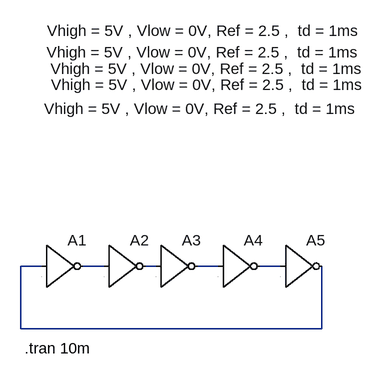
[diagram p0: schematic RING_OSCILLATOR.asc]
RING_OSCILLATOR.asc, the LTspice schematic file:
Version 4
SHEET 1 1020 680
WIRE 96 160 64 160
WIRE 192 160 160 160
WIRE 272 160 256 160
WIRE 368 160 336 160
WIRE 464 160 432 160
WIRE 64 256 64 160
WIRE 528 256 528 160
WIRE 528 256 64 256
SYMBOL Digital\\inv 96 96 R0
WINDOW 3 4 -178 Left 2
SYMATTR InstName A1
SYMATTR Value Vhigh = 5V , Vlow = 0V, Ref = 2.5 ,  td = 1ms
SYMBOL Digital\\inv 192 96 R0
WINDOW 3 -81 -215 Left 2
SYMATTR InstName A2
SYMATTR Value Vhigh = 5V , Vlow = 0V, Ref = 2.5 ,  td = 1ms
SYMBOL Digital\\inv 272 96 R0
WINDOW 3 -162 -240 Left 2
SYMATTR InstName A3
SYMATTR Value Vhigh = 5V , Vlow = 0V, Ref = 2.5 ,  td = 1ms
SYMBOL Digital\\inv 368 96 R0
WINDOW 3 -263 -298 Left 2
SYMATTR InstName A4
SYMATTR Value Vhigh = 5V , Vlow = 0V, Ref = 2.5 ,  td = 1ms
SYMBOL Digital\\inv 464 96 R0
WINDOW 3 -360 -265 Left 2
SYMATTR InstName A5
SYMATTR Value Vhigh = 5V , Vlow = 0V, Ref = 2.5 ,  td = 1ms
TEXT 70 286 Left 2 !.tran 10m

The netlist it stands for:
* RING_OSCILLATOR.asc
A1 N001 0 0 0 0 N002 0 0 BUF Vhigh = 5V , Vlow = 0V, Ref = 2.5 ,  td = 1ms
A2 N002 0 0 0 0 N003 0 0 BUF Vhigh = 5V , Vlow = 0V, Ref = 2.5 ,  td = 1ms
A3 N003 0 0 0 0 N004 0 0 BUF Vhigh = 5V , Vlow = 0V, Ref = 2.5 ,  td = 1ms
A4 N004 0 0 0 0 N005 0 0 BUF Vhigh = 5V , Vlow = 0V, Ref = 2.5 ,  td = 1ms
A5 N005 0 0 0 0 N001 0 0 BUF Vhigh = 5V , Vlow = 0V, Ref = 2.5 ,  td = 1ms
.tran 10m
.backanno
.end